# Altium schematic sheet ExtFlash.SchDoc
size A4
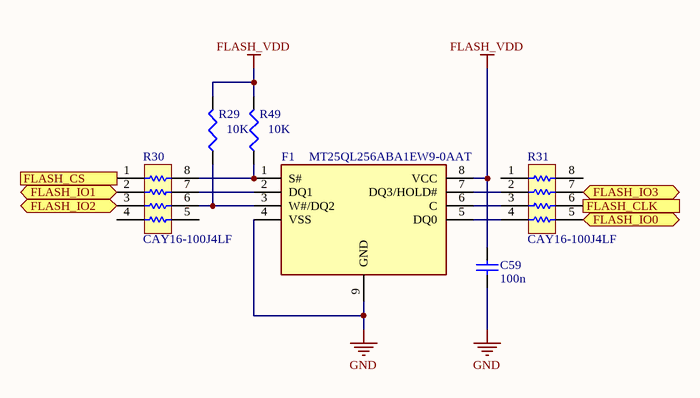
[diagram p0: ExtFlash.SchDoc]

## Parts
C59  100n  [CAPC1608X90X35NL10T15]
F1  MT25QL256ABA1EW9-0AAT  [SON127P800X600X80-9N-D]
R29  value 10K  [J1-0603]
R30  CAY16-100J4LF  [BOUR-CAY16-J4_V]
R31  CAY16-100J4LF  [BOUR-CAY16-J4_V]
R49  value 10K  [J1-0603]

## Ports
FLASH_CLK (in), FLASH_CS (in), FLASH_IO0 (bidir), FLASH_IO1 (bidir), FLASH_IO2 (bidir), FLASH_IO3 (bidir)

## Nets
FLASH_VDD: C59.2 F1.8(VCC) R29.2 R49.2
GND: C59.1 F1.4(VSS) F1.9(GND)
FLASH_CLK: R31.6 ; port FLASH_CLK
FLASH_CS: R30.1 ; port FLASH_CS
FLASH_IO0: R31.5 ; port FLASH_IO0
FLASH_IO1: R30.2 ; port FLASH_IO1
FLASH_IO2: R30.3 ; port FLASH_IO2
FLASH_IO3: R31.7 ; port FLASH_IO3
NetF1_1: F1.1(S#) R30.8 R49.1
NetF1_2: F1.2(DQ1) R30.7
NetF1_3: F1.3(W#/DQ2) R29.1 R30.6
NetF1_5: F1.5(DQ0) R31.4
NetF1_6: F1.6(C) R31.3
NetF1_7: F1.7(DQ3/HOLD#) R31.2

Not connected (* = marked no-connect by the designer): R30 4 5; R31 1 8

## Library data of the parts
C59 = CMP-2006-02891-1: Part Number: GRM188R71H102KA01D; Manufacturer: Murata
F1 = MT25QL256ABA1EW9-0AAT: Integrated Circuit; Manufacturer_Name: Micron; Datasheet Link: https://www.micron.com/~/media/documents/products/data-sheet/nor-flash/serial-nor/mt25q/die-rev-a/mt25q_qljs_l_256_aba_0.pdf; Height: 0.8mm; Manufacturer_Part_Number: MT25QL256ABA1EW9-0AAT; Mouser Part Number: 340-322381-TRAY; Mouser Price/Stock: https://www.mouser.com/Search/Refine.aspx?Keyword=340-322381-TRAY
R29 R49 = Res3: Resistor; Published: 8-Jun-2000; LatestRevisionDate: 29-May-2009; LatestRevisionNote: IPC-7351 Footprint Added.; PackageReference: J1-0603; Publisher: Altium Limited; PackageDescription: Chip Resistor
R30 R31 = CMP-1747-00007-1: Chip Resistor Array, 1 KOhm, +/- 5%, 62.5 mW, -55 to 125 degC, 8-Pin SMD, RoHS, Tape and Reel; Power Rating: 100 mW; Tolerance: 1%; Voltage Rating (DC): 50 V; Resistance: 330 Ohm; Case\Package: 0603; RoHSCompliant: true; Case Code (Metric): 1608; Pins: 2; PackageDescription: 8-Pin Surface Mount Device, Body 1.6 x 3.2 mm, Pitch 0.8 mm; Height: 0.45 mm; Min Operating Temperature: -55 degC; ComponentLink1URL: http://www.bourns.com/; Case Code (Imperial): 0603; Packaging: Tape and Reel; PackageReference: CAY16-J4; ComponentLink1Description: Manufacturer URL; ComponentLink2Description: Datasheet; Length: 1.6 mm; Width: 0.8 mm; Max Operating Temperature: 155 degC; Mount: Surface Mount; DatasheetVersion: Sep-14; Voltage Rating: 50 V; REACH SVHC: No SVHC; ComponentLink2URL: http://www.bourns.com/pdfs/CATCAY.pdf; Package Quantity: 5000